# Altium schematic sheet power.SchDoc: Monolith Power
size A; SheetNumber: 2; SheetTotal: 5
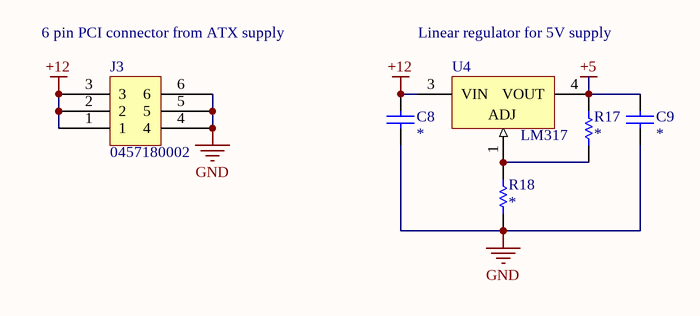
[diagram p0: power.SchDoc]

## Parts
C8  *  [C0603]
C9  *  [C0805]
J3  0457180002
R17  *  [R0603]
R18  *  [R0603]
U4  LM317  [D-PAK]

## Nets
+5: C9.1 R17.1 U4.4(VOUT)
+12: C8.1 J3.1 J3.2 J3.3 U4.3(VIN)
GND: C8.2 C9.2 J3.4 J3.5 J3.6 R18.2
NetR17_2: R17.2 R18.1 U4.1(ADJ)

## Notes on the sheet
- (near J3) 6 pin PCI connector from ATX supply
- Linear regulator for 5V supply

## Library data of the parts
C8 = C0603: 0603 Capacitor; Value: *
C9 = C0805: 0805 Capacitor; Value: *
R17 R18 = R0603: RESISTOR 0603; Value: *
U4 = LM317: Linear Voltage Regulator